# Altium project Key.PrjPcb
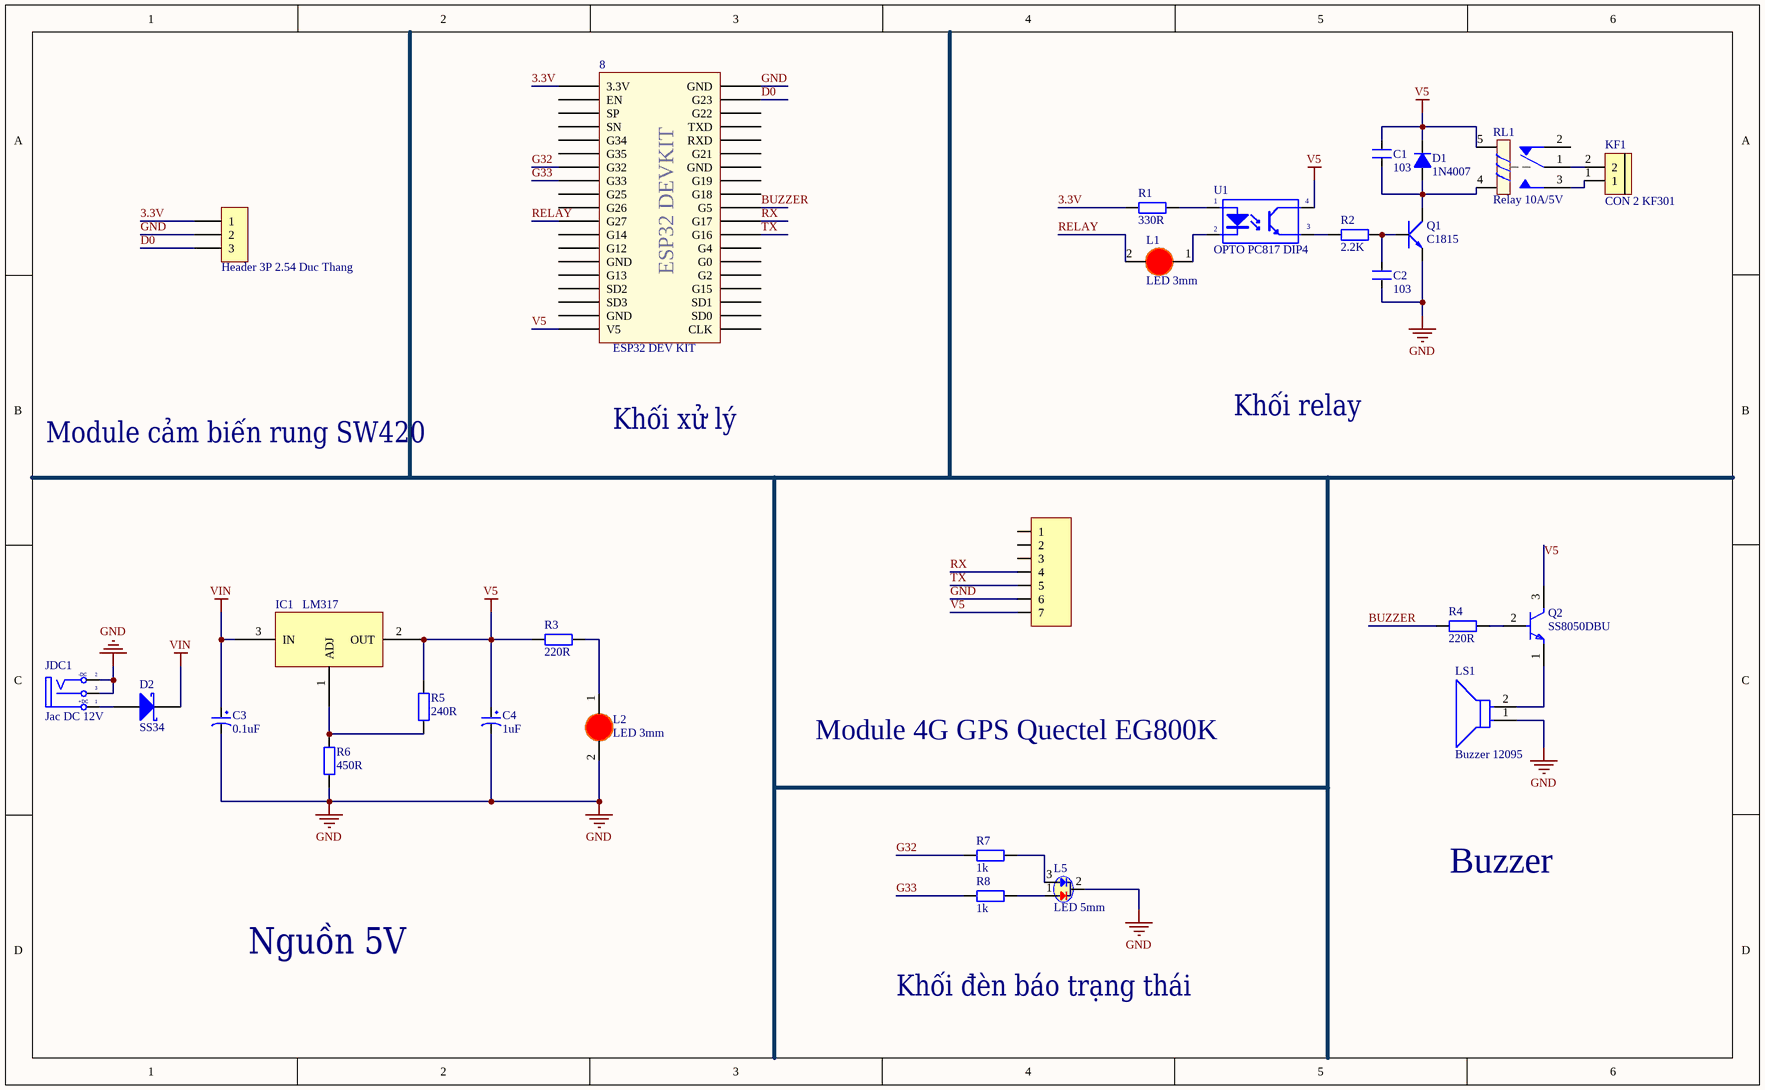
[diagram p0: Key.SchDoc]
1 sheet, 28 parts. Net scope: global (net labels, ports and power ports of the same name join across sheets).
Board file: Key.PcbDoc

## Sheet Key.SchDoc
size 330 x 203 mm; SheetNumber: 1; SheetTotal: 1

### Parts
8  ESP32 DEV KIT  [ESP32 DEVKIT]
C1  103  [CN1.5]
C2  103  [CN1.5]
C3  0.1uF  [CP1/2]
C4  1uF  [CP1/2]
D1  1N4007  [DIODE 1A]
D2  SS34  [SS14]
H1  Header 3P 2.54 Duc Thang  [XH2.54M-3]
IC1  LM317  [SOT223]
JDC1  Jac DC 12V  [DC-IN]
JP2  (no value)  [JP 1x7 CT]
KF1  CON 2 KF301  [Con 2 KF301 5.08]
L1  LED 3mm  [LED-3MM-RED]
L2  LED 3mm  [LED-3MM-RED]
L5  LED 5mm  [LED-5MM 2 MAU]
LS1  Buzzer 12095  [FP-MCKPX-G1203A-K4056-MFG]
Q1  C1815  [TO92]
Q2  SS8050DBU  [FP-135AN-MFG]
R1  330R  [tro vach 1/4w]
R2  2.2K  [tro vach 1/4w]
R3  220R  [tro vach 1/4w]
R4  220R  [tro vach 1/4w]
R5  240R  [tro vach 1/4w]
R6  450R  [tro vach 1/4w]
R7  1k  [tro vach 1/4w]
R8  1k  [tro vach 1/4w]
RL1  Relay 10A/5V  [Relay 5 Chan SRD]
U1  OPTO PC817 DIP4  [DIP4]

### Nets
GND: 8.38(GND) C2.1 C3.2 C4.2 H1.2 JDC1.2(TN) JDC1.3(S) JP2.6 L2.2(K) L5.2(Katot) LS1.1(C) Q1.1(E) R6.1
V5: 8.19(V5) C1.2 C4.1 D1.2(K) IC1.2(OUT) JP2.7 Q2.3(C) R3.1 R5.2 RL1.5 U1.4(C)
VIN: C3.1 D2.2(K) IC1.3(IN)
3.3V: 8.1(3.3V) H1.1 R1.1
BUZZER: 8.29(G5) R4.1
D0: 8.37(G23) H1.3
G32: 8.7(G32) R7.1
G33: 8.8(G33) R8.1
RELAY: 8.11(G27) L1.2(K)
RX: 8.28(G17) JP2.4
TX: 8.27(G16) JP2.5
NetC1_1: C1.1 D1.1(A) Q1.2(C) RL1.4
NetC2_2: C2.2 Q1.3(B) R2.2
NetD2_1: D2.1(A) JDC1.1(T)
NetIC1_1: IC1.1(ADJ) R5.1 R6.2
NetKF1_1: KF1.1 RL1.3
NetKF1_2: KF1.2 RL1.1
NetL1_1: L1.1(A) U1.2(K)
NetL2_1: L2.1(A) R3.2
NetL5_1: L5.1(D) R8.2
NetL5_3: L5.3(X) R7.2
NetLS1_2: LS1.2(A) Q2.1(E)
NetQ2_2: Q2.2(B) R4.2
NetR1_2: R1.2 U1.1(A)
NetR2_1: R2.1 U1.3(E)

Not connected (* = marked no-connect by the designer): 8 2(EN) 3(SP) 4(SN) 5(G34) 6(G35) 9(G25) 10(G26) 12(G14) 13(G12) 14(GND) 15(G13) 16(SD2) 17(SD3) 18(GND) 20(CLK) 21(SD0) 22(SD1) 23(G15) 24(G2) 25(G0) 26(G4) 30(G18) 31(G19) 32(GND) 33(G21) 34(RXD) 35(TXD) 36(G22); JP2 1 2 3; RL1 2

### Notes on the sheet
- Khối xử lý
- Khối relay
- Module cảm biến rung SW420
- Module 4G GPS Quectel EG800K
- Buzzer
- Nguồn 5V
- Khối đèn báo trạng thái
- (in symbol DCIN) -DC; +DC
- (in symbol ESP32 DEV KIT) ESP32 DEVKIT

### Library data of the parts
C1 C2 = CN1.5: Cap np 682pF => 104pF; Value: 0.01uF
C3 C4 = CP1: Cap P  0,1uF < 22uF , 16 - 50V; Value: 10uF/50V; Description 1: 10 => 220uF/6,3V/10V - 10uF => 100uF/16V; Description 2: 0,1uF => 33uF/50V - 10uF => 22uF/63V; Description 3: 0,47uF => 10uF/100V
D1 = Diode 1N4007: Cắm; Ten_Linh_Kien: Diode 1N4007 1A (DIP); Don_Vi: Con; Ma_Hang: MH001063; Ghi Chu: *; Kieu_Chan: *; Chung_Loai: Cắm
D2 = D Schottky: Schottky Diode; Published: 8-Jun-2000; LatestRevisionDate: 17-Jul-2002; LatestRevisionNote: Re-released for DXP Platform.; PackageReference: SMB; Publisher: Altium Limited; PackageDescription: DO-214-AA/SMB; 2 C-Bend Leads; Body 5.3 x 3.6 mm, inc. leads (LxW); Code_JEDEC: DO-214-AA
H1 = Header 3P 2.54 Duc Thang: Cắm; Ten_Linh_Kien: Header 3P XH2.54-3P Đực Thẳng; Don_Vi: Con; Ma_Hang: MH001292; Chung_Loai: Cắm
IC1 = LM317 TO223 SMD: Dán; Ten_Linh_Kien: LM317 TO223 ADJ 0.5A (N07A,N01A); Ma_Hang: MH003617; Don_Vi: Con; Kieu_Chan: *; Ghi_Chu: *; Chung_Loai: Dán
JDC1 = DCIN: Jac DC input; Value: Jac DC
JP2 = JP 1x7 2.54 Cai Thang: Cắm; Ten_Linh_Kien: Jump Đơn Cái 2.54MM 1x20P Thẳng; Don_Vi: Con; Ma_Hang: MH004006; Ghi_Chu: *; Kieu_Chan: *; Chung_Loai: Cắm
KF1 = CON 2 KF301: Cắm; Ma_Hang: MH000987; Ten_Linh_Kien: CON 2 KF301-2P 5.08MM Xanh Dương; Chung_Loai: Cắm; Ghi_Chu: *; Kieu_Chan: *; Don_Vi: Con
L1 L2 = LED 3mm Do: Cắm; Don_Vi: Con; Ma_Hang: MH003892; Ten_Linh_Kien: Led 3MM Phủ Đỏ (10c); Ghi_Chu: *; Kieu_Chan: *; Chung_Loai: Cắm
L5 = LED 5mm 2 mau Katot chung: Cắm; Don_Vi: Con; Ma_Hang: MH001547; Ten_Linh_Kien: Led 5MM 2 Mầu Katot Xanh Đỏ (10c); Ghi_Chu: *; Kieu_Chan: *; Chung_Loai: Cắm
LS1 = CMP-12433-000001-1: MAGNETIC BUZZER AND TRANSDUCER - More Details; Manufacturer Part Number: MCKPX-G1203A-K4056; Manufacturer: Multicomp Pro; Operating Supply Voltage: 3V; Current: 30mA; Frequency: 2300Hz; Max Supply Voltage: 5V; Min Supply Voltage: 2V; Standoff Height: 0.5mm; ComponentLink2Description: Datasheet; ComponentLink2URL: http://www.farnell.com/datasheets/1498149.pdf?_ga=2.17855225.1157923166.1572356775-536200964.1569240579; Temperature Range High: +70°C; Device Class L2: Audio Products; Temperature Range Low: -20°C; Package: 0; Temperature: -20°C to +70°C; Category: Speak; Octopart: https://octopart.com/mckpx-g1203a-k4056-multicomp-12157154; RoHS: TRUE; Lead Free: Yes; Height: 9.5mm; Device Class L1: Electromechanical; Automotive: No; Device Class L3: Buzzers
Q1 = Trans C1815 DIP: NPN transistor; Value: C9014
Q2 = CMP-00278-84331634-1: SS8050DBU Bipolar (BJT) Single Transistor, NPN, 25 V, 100 MHz, 1 W, 1.5 A, 160; Manufacturer Lifecycle Status: ACTIVE; Collector Base Voltage (VCBO): 40V; Power Dissipation: 1W; Max Junction Temperature (Tj): 150°C; Frequency: 100MHz; Output Power: 2W; Collector Emitter Voltage (VCEO): 25V; Max Collector Current: 1.5A; Collector Emitter Saturation Voltage: 500mV; Number of Elements: 1; Emitter Base Voltage (VEBO): 6V; hFE Min: 85; RoHS: Compliant; Lifecycle Status: Production; Lead Free: Lead Free; Transition Frequency: 100MHz; Case/Package: TO-92; Width: 3.86mm; Min Operating Temperature: -65°C; Element Configuration: Single; Gain Bandwidth Product: 100MHz; REACH SVHC: No SVHC; Max Frequency: 100MHz; Radiation Hardening: No; Current Rating: 1.5A; Mount: Through Hole; Max Operating Temperature: 150°C; Polarity: NPN; Number of Pins: 3; Collector Emitter Breakdown Voltage: 25V; Schedule B: 8541290080, 8541290080|8541290080|8541290080|8541290080|8541290080; Packaging: Bulk; Weight: 179mg; NexarPartId: 84331634; Voltage Rating (DC): 25V; Max Power Dissipation: 1W; Height: 4.58mm; Length: 4.58mm
R1 = Tro Vach 1/4W 1% 330R: Cắm; Don_Vi: Con; So_Chan: 2; Ten_Linh_Kien: Trở Vạch 1/4w 1% 330R; Ma_Hang: MH006348; Chung_Loai: Cắm; Kieu_Chan: *
R2 = Tro Vach 1/4W 5% 1k: Cắm; Don_Vi: Con; So_Chan: 2; Ten_Linh_Kien: Trở Vạch 1/4w 5% 1k; Ma_Hang: MH007390; Chung_Loai: Cắm; Kieu_Chan: *
R3-R8 = Tro Vach 1/4W 5% 220R: Cắm; Don_Vi: Con; So_Chan: 2; Ten_Linh_Kien: Trở Vạch 1/4w 5% 220R; Ma_Hang: MH007300; Chung_Loai: Cắm; Kieu_Chan: *
RL1 = Relay 5 Chan SRD: Relay 5 Chan; Ma_Hang: MH009374; Ten: Relay 5V10A SRD-05VDC-SL-C Chính Hãng
U1 = OPTO PC817 DIP4: Single Opto; Value: PC817